# EAGLE schematic esp32_led (EAGLE 9.6.2)
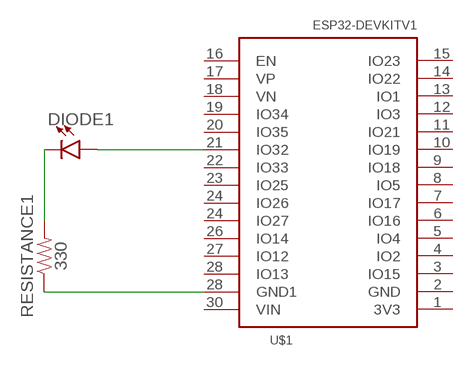
[diagram p0: schematic, sheet 1]

## Parts
DIODE1  LED-3MM-NO_SILK  [LED_3MM-NS]
RESISTANCE1  330  330OHM-HORIZ-1/10W-5%  [AXIAL-0.3]
U$1  ESP32DEVKITV1  [ESP32-DEVKITV1]

## Nets
N$1: DIODE1.K(C) RESISTANCE1.P$2
N$2: DIODE1.A U$1.21(IO32)
N$3: RESISTANCE1.P$1 U$1.28(GND1)
Unconnected: U$1.1(3V3) U$1.2(GND) U$1.3(IO15) U$1.4(IO2) U$1.5(IO4) U$1.6(IO16) U$1.7(IO17) U$1.8(IO5) U$1.9(IO18) U$1.10(IO19) U$1.11(IO21) U$1.12(IO3) U$1.13(IO1) U$1.14(IO22) U$1.15(IO23) U$1.16(EN) U$1.17(VP) U$1.18(VN) U$1.19(IO34) U$1.20(IO35) U$1.22(IO33) U$1.23(IO25) U$1.24(IO26) U$1.24(IO27) U$1.26(IO14) U$1.27(IO12) U$1.28(IO13) U$1.30(VIN)

## Library data of the parts
DIODE1 = SparkFun-LED:LED: LED (Generic) Standard schematic elements and footprints for 5mm, 3mm, 1206, and 0603 sized LEDs. Generic LEDs with no color specified.
RESISTANCE1 = SparkFun-Resistors:330OHM: 330Ω resistor A resistor is a passive two-terminal electrical component that implements electrical resistance as a circuit element. Resistors act to reduce current flow, and, at the same time, act to lower voltage levels within circuits. - Wikipedia; PROD_ID: RES-8371
U$1 = ESP32-DEVKITV1:ESP32DEVKITV1